# Altium schematic sheet LEDLadderSchem.SchDoc
size A4
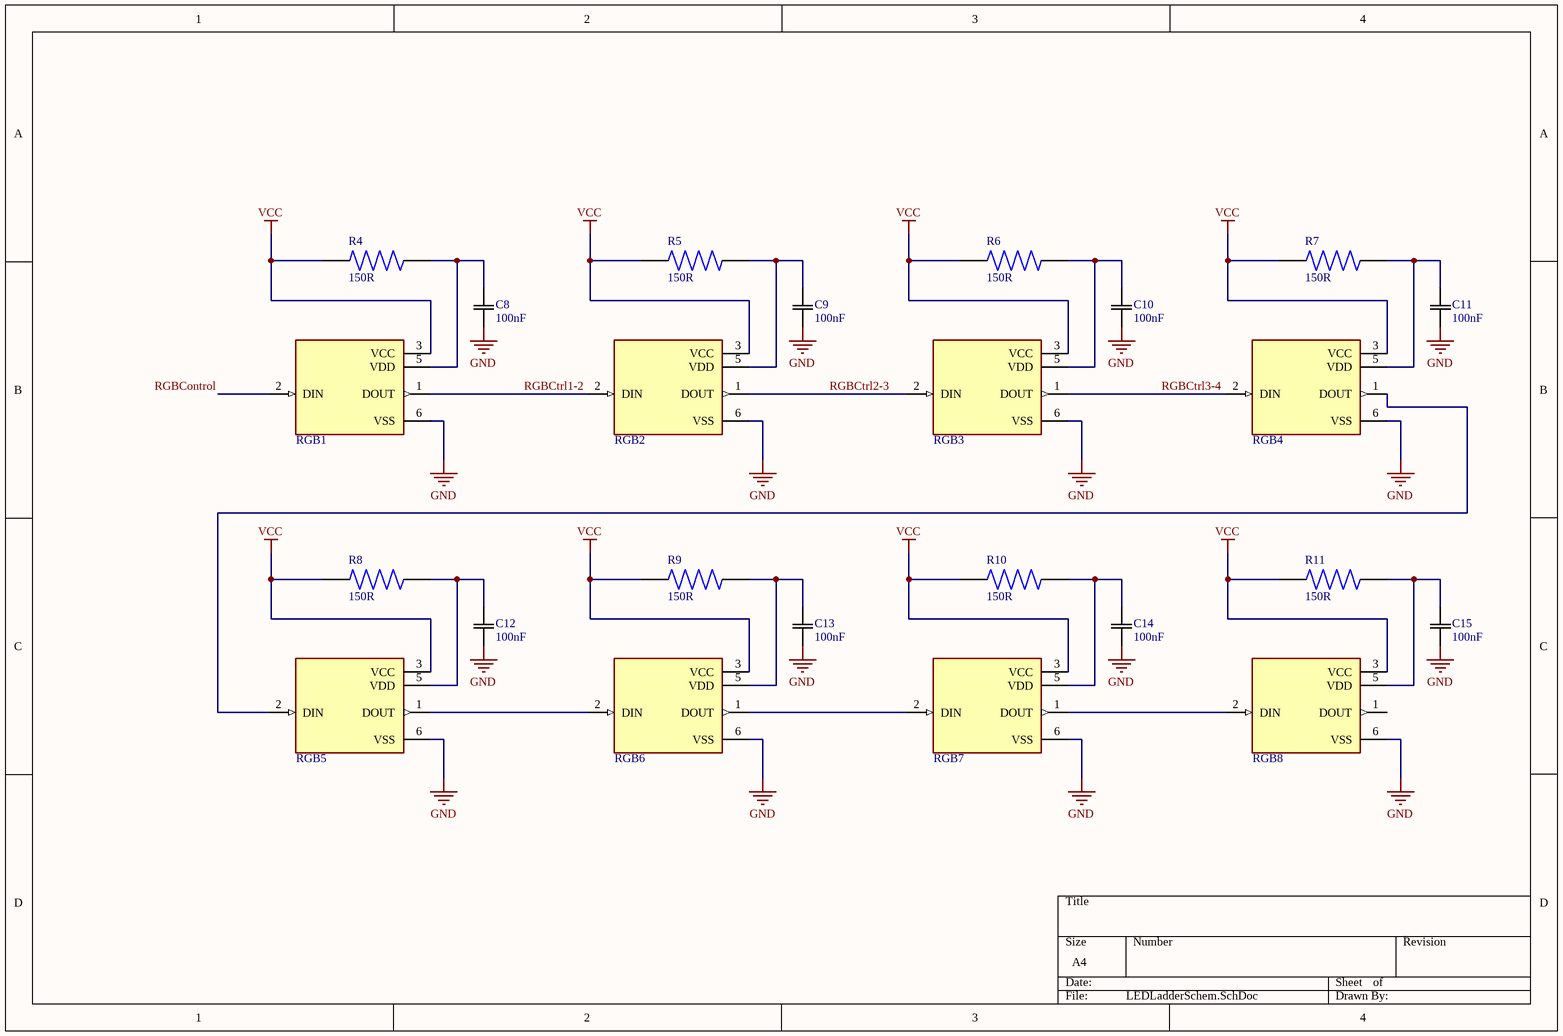
[diagram p0: LEDLadderSchem.SchDoc]

## Parts
C8  100nF  [CAPC0603_87N_KEM-M]
C9  100nF  [CAPC0603_87N_KEM-M]
C10  100nF  [CAPC0603_87N_KEM-M]
C11  100nF  [CAPC0603_87N_KEM-M]
C12  100nF  [CAPC0603_87N_KEM-M]
C13  100nF  [CAPC0603_87N_KEM-M]
C14  100nF  [CAPC0603_87N_KEM-M]
C15  100nF  [CAPC0603_87N_KEM-M]
R4  150R  [RES0608_150OHM]
R5  150R  [RES0608_150OHM]
R6  150R  [RES0608_150OHM]
R7  150R  [RES0608_150OHM]
R8  150R  [RES0608_150OHM]
R9  150R  [RES0608_150OHM]
R10  150R  [RES0608_150OHM]
R11  150R  [RES0608_150OHM]
RGB1  RGB-LED  [LED_RGB]  (value not drawn)
RGB2  RGB-LED  [LED_RGB]  (value not drawn)
RGB3  RGB-LED  [LED_RGB]  (value not drawn)
RGB4  RGB-LED  [LED_RGB]  (value not drawn)
RGB5  RGB-LED  [LED_RGB]  (value not drawn)
RGB6  RGB-LED  [LED_RGB]  (value not drawn)
RGB7  RGB-LED  [LED_RGB]  (value not drawn)
RGB8  RGB-LED  [LED_RGB]  (value not drawn)

## Nets
GND: C8.1 C9.1 C10.1 C11.1 C12.1 C13.1 C14.1 C15.1 RGB1.6(VSS) RGB2.6(VSS) RGB3.6(VSS) RGB4.6(VSS) RGB5.6(VSS) RGB6.6(VSS) RGB7.6(VSS) RGB8.6(VSS)
VCC: R4.1 R5.1 R6.1 R7.1 R8.1 R9.1 R10.1 R11.1 RGB1.3(VCC) RGB2.3(VCC) RGB3.3(VCC) RGB4.3(VCC) RGB5.3(VCC) RGB6.3(VCC) RGB7.3(VCC) RGB8.3(VCC)
RGBControl: RGB1.2(DIN)
RGBCtrl1-2: RGB1.1(DOUT) RGB2.2(DIN)
RGBCtrl2-3: RGB2.1(DOUT) RGB3.2(DIN)
RGBCtrl3-4: RGB3.1(DOUT) RGB4.2(DIN)
NetC8_2: C8.2 R4.2 RGB1.5(VDD)
NetC9_2: C9.2 R5.2 RGB2.5(VDD)
NetC10_2: C10.2 R6.2 RGB3.5(VDD)
NetC11_2: C11.2 R7.2 RGB4.5(VDD)
NetC12_2: C12.2 R8.2 RGB5.5(VDD)
NetC13_2: C13.2 R9.2 RGB6.5(VDD)
NetC14_2: C14.2 R10.2 RGB7.5(VDD)
NetC15_2: C15.2 R11.2 RGB8.5(VDD)
NetRGB4_1: RGB4.1(DOUT) RGB5.2(DIN)
NetRGB5_1: RGB5.1(DOUT) RGB6.2(DIN)
NetRGB6_1: RGB6.1(DOUT) RGB7.2(DIN)
NetRGB7_1: RGB7.1(DOUT) RGB8.2(DIN)

Not connected (* = marked no-connect by the designer): RGB8 1(DOUT)

## Library data of the parts
C8-C15 = C0603C103J5JACTU: CAP CER 10000PF 50V U2J 0603; Manufacturer: KEMET; Capacitance: 10nF; Tolerance: 5%; Supplier 1: Digi-Key; Supplier Part Number 1: 399-13384-1-ND; Manufacturer Part Number: C0603C103J5JACTU; RoHS: Yes; Category: Ceramic Capacitors; Stock 1: 2465; Pricing 1: 1=0.30000, 10=0.20400, 50=0.13560, 100=0.11530, 500=0.08142, 1000=0.07124 (USD); Mount: Surface Mount; Case/Package: 0603; Case Code (Metric): 1608; Case Code (Imperial): 0603; Min Operating Temperature: -55°C; Max Operating Temperature: 125°C; Packaging: Cut Tape; Voltage Rating: 50V; Dielectric: U2J; Length: 0.063inch; Width: 0.032inch; Thickness: 0.034inch; REACH SVHC: No SVHC; RoHS Compliant: Yes; ComponentLink1URL: http://www.farnell.com/datasheets/2600114.pdf?src-supplier=Farnell; ComponentLink1Description: http://www.farnell.com/datasheets/2600114.pdf?src-supplier=Farnell; ComponentLink2URL: http://www.farnell.com/datasheets/2157975.pdf?src-supplier=Element14; ComponentLink2Description: http://www.farnell.com/datasheets/2157975.pdf?src-supplier=Element14; ComponentLink3URL: https://api.kemet.com/component-edge/download/datasheet/C0603C103J5JAC7867.pdf?src-supplier=Digi-Key; ComponentLink3Description: https://api.kemet.com/component-edge/download/datasheet/C0603C103J5JAC7867.pdf?src-supplier=Digi-Key; ComponentLink4URL: http://www.kemet.com/docfinder?Partnumber=C0603C103J5JAC7867&src-supplier=Digi-Key; ComponentLink4Description: http://www.kemet.com/docfinder?Partnumber=C0603C103J5JAC7867&src-supplier=Digi-Key
R4-R11 = CRCW0603150RFKEAHP: Res Thick Film 0603 150 Ohm 1% 0.33W(1/3W) ±100ppm/°C Pad SMD Automotive T/R; Manufacturer: Vishay; Power Rating: 250mW; Voltage Rating: 75V; Supplier 1: Digi-Key; Supplier Part Number 1: 541-150SCT-ND; Manufacturer Part Number: CRCW0603150RFKEAHP; RoHS: Yes; Category: Chip SMD Resistors; Stock 1: 10924; Pricing 1: 1=0.17000, 10=0.14800, 100=0.05790, 1000=0.02422, 2500=0.02220 (USD); Mount: Surface Mount; Case/Package: 0603; Case Code (Metric): 1608; Case Code (Imperial): 0603; Contact Plating: Tin; Weight: 7.1E-05oz; Min Operating Temperature: -55°C; Max Operating Temperature: 155°C; Package Quantity: 1; Resistance: 150R; Tolerance: 1%; Packaging: Tape and Reel; Resistor Type: Thick Film; Number of Terminations: 2; Max Power Dissipation: 250mW; Temperature Coefficient: 100ppm/°C; Features: Automotive AEC-Q200; Series: CRCW-HP; Termination: SMD/SMT; Voltage Rating (DC): 75V; Technology: THICK FILM; Resistance Tolerance: 1%; Construction: Rectangular; Length: 1.55mm; Width: 0.033inch; Height: 0.45mm; Depth: 0.85mm; Radiation Hardening: No; Lead Free: Lead Free; RoHS Compliant: Yes; REACH SVHC: Unknown; Military Standard: Not; ComponentLink1URL: https://datasheet.ciiva.com/6551/crcwhpe3-6551676.pdf?src-supplier=Digi-Key; ComponentLink1Description: https://datasheet.ciiva.com/6551/crcwhpe3-6551676.pdf?src-supplier=Digi-Key; ComponentLink2URL: https://datasheet.ciiva.com/12559/crcwhpe3-46056-12559198.pdf?src-supplier=Mouser; ComponentLink2Description: https://datasheet.ciiva.com/12559/crcwhpe3-46056-12559198.pdf?src-supplier=Mouser
RGB1-RGB8 = LED_RGB: ADDRESS LED DISCRETE SERIAL RGB; Manufacturer: SparkFun; Manufacturer Part Number: COM-11821; Number of LEDs: 1; Supplier 1: Digi-Key; Supplier Part Number 1: 1568-1800-ND; RoHS: No; Stock 1: 3968; Pricing 1: 1=0.50000 (USD); Mount: Surface Mount; Color: Blue,Green,Red; Interface: Serial; Length: 5mm; Width: 5mm; ComponentLink1URL: https://media.digikey.com/pdf/Data%20Sheets/Sparkfun%20PDFs/WS2812_Breakout_Hookup_Guide.pdf?src-supplier=Digi-Key; ComponentLink1Description: https://media.digikey.com/pdf/Data%20Sheets/Sparkfun%20PDFs/WS2812_Breakout_Hookup_Guide.pdf?src-supplier=Digi-Key; ComponentLink2URL: http://cdn.sparkfun.com/datasheets/Components/LED/WS2812.pdf?src-supplier=Digi-Key; ComponentLink2Description: http://cdn.sparkfun.com/datasheets/Components/LED/WS2812.pdf?src-supplier=Digi-Key